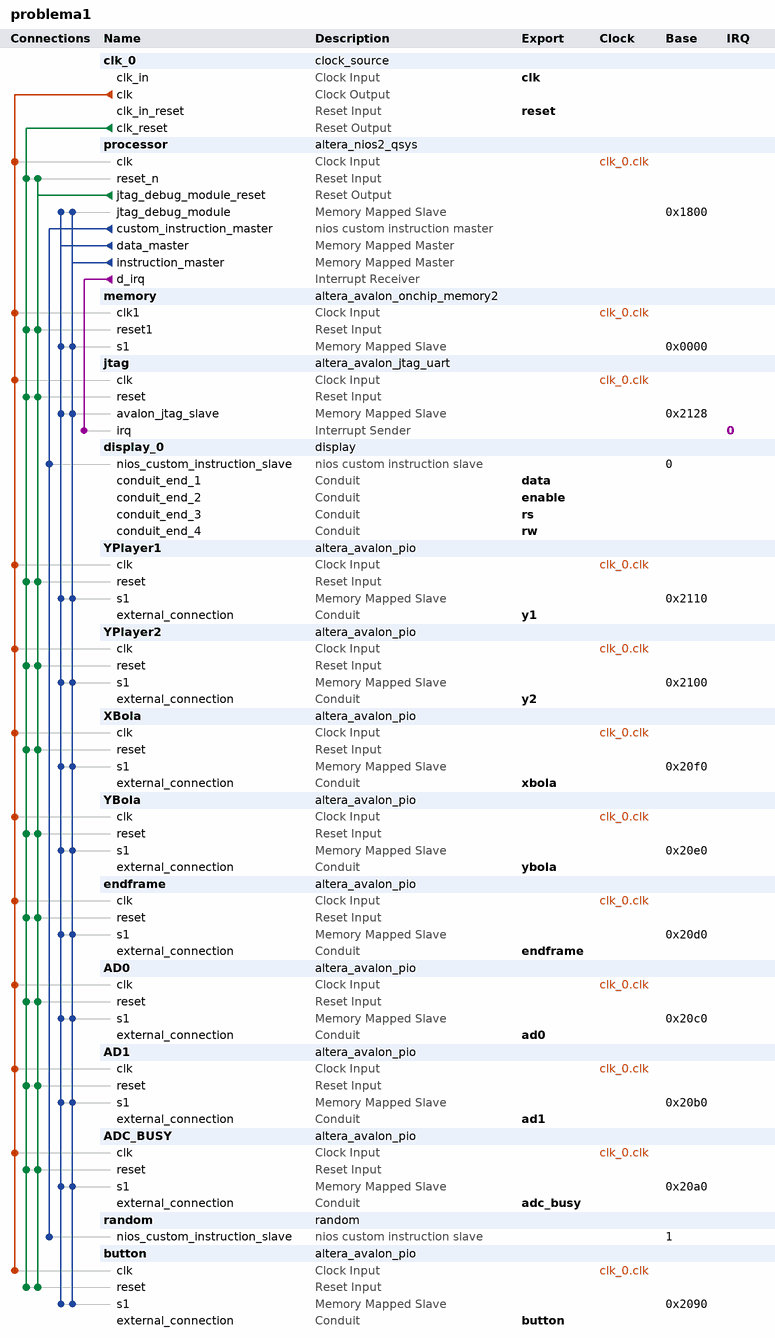
[diagram p0: system contents]
# Platform Designer (Qsys) system problema1, Cyclone IV E EP4CE30F23C7
# Parameters at their usual value, and those the tool derives, are not listed.
package require -exact qsys 13.1
create_system problema1
set_project_property DEVICE_FAMILY {Cyclone IV E}
set_project_property DEVICE EP4CE30F23C7

add_instance clk_0 clock_source 13.1
set_instance_parameter_value clk_0 clockFrequency 50000000

add_instance processor altera_nios2_qsys 13.1
set_instance_parameter_value processor resetSlave memory.s1
set_instance_parameter_value processor mmu_TLBMissExcSlave None
set_instance_parameter_value processor exceptionSlave memory.s1
set_instance_parameter_value processor breakSlave processor.jtag_debug_module
set_instance_parameter_value processor impl Tiny
set_instance_parameter_value processor icache_size 4096

add_instance memory altera_avalon_onchip_memory2 13.1
set_instance_parameter_value memory dataWidth 32
set_instance_parameter_value memory dualPort false
set_instance_parameter_value memory initMemContent true
set_instance_parameter_value memory initializationFileName onchip_mem.hex
set_instance_parameter_value memory memorySize 4096

add_instance jtag altera_avalon_jtag_uart 13.1
set_instance_parameter_value jtag simInteractiveOptions NO_INTERACTIVE_WINDOWS

add_instance display_0 display 1.0

add_instance YPlayer1 altera_avalon_pio 13.1
set_instance_parameter_value YPlayer1 direction Output
set_instance_parameter_value YPlayer1 width 10

add_instance YPlayer2 altera_avalon_pio 13.1
set_instance_parameter_value YPlayer2 direction Output
set_instance_parameter_value YPlayer2 width 10

add_instance XBola altera_avalon_pio 13.1
set_instance_parameter_value XBola direction Output
set_instance_parameter_value XBola width 10

add_instance YBola altera_avalon_pio 13.1
set_instance_parameter_value YBola direction Output
set_instance_parameter_value YBola width 10

add_instance endframe altera_avalon_pio 13.1
set_instance_parameter_value endframe direction Input
set_instance_parameter_value endframe width 1

add_instance AD0 altera_avalon_pio 13.1
set_instance_parameter_value AD0 direction Input
set_instance_parameter_value AD0 width 8

add_instance AD1 altera_avalon_pio 13.1
set_instance_parameter_value AD1 direction Input
set_instance_parameter_value AD1 width 8

add_instance ADC_BUSY altera_avalon_pio 13.1
set_instance_parameter_value ADC_BUSY direction Input
set_instance_parameter_value ADC_BUSY width 1

add_instance random random 1.0

add_instance button altera_avalon_pio 13.1
set_instance_parameter_value button direction Input
set_instance_parameter_value button width 2

# connections
add_connection clk_0.clk AD0.clk clock
add_connection clk_0.clk AD1.clk clock
add_connection clk_0.clk ADC_BUSY.clk clock
add_connection clk_0.clk button.clk clock
add_connection clk_0.clk endframe.clk clock
add_connection clk_0.clk jtag.clk clock
add_connection clk_0.clk memory.clk1 clock
add_connection clk_0.clk processor.clk clock
add_connection clk_0.clk XBola.clk clock
add_connection clk_0.clk YBola.clk clock
add_connection clk_0.clk YPlayer1.clk clock
add_connection clk_0.clk YPlayer2.clk clock
add_connection clk_0.clk_reset AD0.reset reset
add_connection clk_0.clk_reset AD1.reset reset
add_connection clk_0.clk_reset ADC_BUSY.reset reset
add_connection clk_0.clk_reset button.reset reset
add_connection clk_0.clk_reset endframe.reset reset
add_connection clk_0.clk_reset jtag.reset reset
add_connection clk_0.clk_reset memory.reset1 reset
add_connection clk_0.clk_reset processor.reset_n reset
add_connection clk_0.clk_reset XBola.reset reset
add_connection clk_0.clk_reset YBola.reset reset
add_connection clk_0.clk_reset YPlayer1.reset reset
add_connection clk_0.clk_reset YPlayer2.reset reset
add_connection processor.jtag_debug_module_reset AD0.reset reset
add_connection processor.jtag_debug_module_reset AD1.reset reset
add_connection processor.jtag_debug_module_reset ADC_BUSY.reset reset
add_connection processor.jtag_debug_module_reset button.reset reset
add_connection processor.jtag_debug_module_reset endframe.reset reset
add_connection processor.jtag_debug_module_reset jtag.reset reset
add_connection processor.jtag_debug_module_reset memory.reset1 reset
add_connection processor.jtag_debug_module_reset processor.reset_n reset
add_connection processor.jtag_debug_module_reset XBola.reset reset
add_connection processor.jtag_debug_module_reset YBola.reset reset
add_connection processor.jtag_debug_module_reset YPlayer1.reset reset
add_connection processor.jtag_debug_module_reset YPlayer2.reset reset
add_connection processor.data_master AD0.s1 avalon
set_connection_parameter_value processor.data_master/AD0.s1 baseAddress 0x20c0
add_connection processor.data_master AD1.s1 avalon
set_connection_parameter_value processor.data_master/AD1.s1 baseAddress 0x20b0
add_connection processor.data_master ADC_BUSY.s1 avalon
set_connection_parameter_value processor.data_master/ADC_BUSY.s1 baseAddress 0x20a0
add_connection processor.data_master button.s1 avalon
set_connection_parameter_value processor.data_master/button.s1 baseAddress 0x2090
add_connection processor.data_master endframe.s1 avalon
set_connection_parameter_value processor.data_master/endframe.s1 baseAddress 0x20d0
add_connection processor.data_master jtag.avalon_jtag_slave avalon
set_connection_parameter_value processor.data_master/jtag.avalon_jtag_slave baseAddress 0x2128
add_connection processor.data_master memory.s1 avalon
set_connection_parameter_value processor.data_master/memory.s1 baseAddress 0x0000
add_connection processor.data_master processor.jtag_debug_module avalon
set_connection_parameter_value processor.data_master/processor.jtag_debug_module baseAddress 0x1800
add_connection processor.data_master XBola.s1 avalon
set_connection_parameter_value processor.data_master/XBola.s1 baseAddress 0x20f0
add_connection processor.data_master YBola.s1 avalon
set_connection_parameter_value processor.data_master/YBola.s1 baseAddress 0x20e0
add_connection processor.data_master YPlayer1.s1 avalon
set_connection_parameter_value processor.data_master/YPlayer1.s1 baseAddress 0x2110
add_connection processor.data_master YPlayer2.s1 avalon
set_connection_parameter_value processor.data_master/YPlayer2.s1 baseAddress 0x2100
add_connection processor.instruction_master AD0.s1 avalon
set_connection_parameter_value processor.instruction_master/AD0.s1 baseAddress 0x20c0
add_connection processor.instruction_master AD1.s1 avalon
set_connection_parameter_value processor.instruction_master/AD1.s1 baseAddress 0x20b0
add_connection processor.instruction_master ADC_BUSY.s1 avalon
set_connection_parameter_value processor.instruction_master/ADC_BUSY.s1 baseAddress 0x20a0
add_connection processor.instruction_master button.s1 avalon
set_connection_parameter_value processor.instruction_master/button.s1 baseAddress 0x2090
add_connection processor.instruction_master endframe.s1 avalon
set_connection_parameter_value processor.instruction_master/endframe.s1 baseAddress 0x20d0
add_connection processor.instruction_master jtag.avalon_jtag_slave avalon
set_connection_parameter_value processor.instruction_master/jtag.avalon_jtag_slave baseAddress 0x2128
add_connection processor.instruction_master memory.s1 avalon
set_connection_parameter_value processor.instruction_master/memory.s1 baseAddress 0x0000
add_connection processor.instruction_master processor.jtag_debug_module avalon
set_connection_parameter_value processor.instruction_master/processor.jtag_debug_module baseAddress 0x1800
add_connection processor.instruction_master XBola.s1 avalon
set_connection_parameter_value processor.instruction_master/XBola.s1 baseAddress 0x20f0
add_connection processor.instruction_master YBola.s1 avalon
set_connection_parameter_value processor.instruction_master/YBola.s1 baseAddress 0x20e0
add_connection processor.instruction_master YPlayer1.s1 avalon
set_connection_parameter_value processor.instruction_master/YPlayer1.s1 baseAddress 0x2110
add_connection processor.instruction_master YPlayer2.s1 avalon
set_connection_parameter_value processor.instruction_master/YPlayer2.s1 baseAddress 0x2100
add_connection processor.d_irq jtag.irq interrupt
set_connection_parameter_value processor.d_irq/jtag.irq irqNumber 0
add_connection processor.custom_instruction_master display_0.nios_custom_instruction_slave nios_custom_instruction
set_connection_parameter_value processor.custom_instruction_master/display_0.nios_custom_instruction_slave CIName display_0
set_connection_parameter_value processor.custom_instruction_master/display_0.nios_custom_instruction_slave baseAddress 0
add_connection processor.custom_instruction_master random.nios_custom_instruction_slave nios_custom_instruction
set_connection_parameter_value processor.custom_instruction_master/random.nios_custom_instruction_slave CIName random
set_connection_parameter_value processor.custom_instruction_master/random.nios_custom_instruction_slave baseAddress 1

# exported interfaces
add_interface clk clock sink
set_interface_property clk EXPORT_OF clk_0.clk_in
add_interface reset reset sink
set_interface_property reset EXPORT_OF clk_0.clk_in_reset
add_interface data conduit end
set_interface_property data EXPORT_OF display_0.conduit_end_1
add_interface enable conduit end
set_interface_property enable EXPORT_OF display_0.conduit_end_2
add_interface rs conduit end
set_interface_property rs EXPORT_OF display_0.conduit_end_3
add_interface rw conduit end
set_interface_property rw EXPORT_OF display_0.conduit_end_4
add_interface y1 conduit end
set_interface_property y1 EXPORT_OF YPlayer1.external_connection
add_interface y2 conduit end
set_interface_property y2 EXPORT_OF YPlayer2.external_connection
add_interface xbola conduit end
set_interface_property xbola EXPORT_OF XBola.external_connection
add_interface ybola conduit end
set_interface_property ybola EXPORT_OF YBola.external_connection
add_interface endframe conduit end
set_interface_property endframe EXPORT_OF endframe.external_connection
add_interface ad0 conduit end
set_interface_property ad0 EXPORT_OF AD0.external_connection
add_interface ad1 conduit end
set_interface_property ad1 EXPORT_OF AD1.external_connection
add_interface adc_busy conduit end
set_interface_property adc_busy EXPORT_OF ADC_BUSY.external_connection
add_interface button conduit end
set_interface_property button EXPORT_OF button.external_connection

set_interconnect_requirement {$system} qsys_mm.clockCrossingAdapter HANDSHAKE
set_interconnect_requirement {$system} qsys_mm.maxAdditionalLatency 1
set_interconnect_requirement {$system} qsys_mm.insertDefaultSlave false

save_system problema1.qsys
